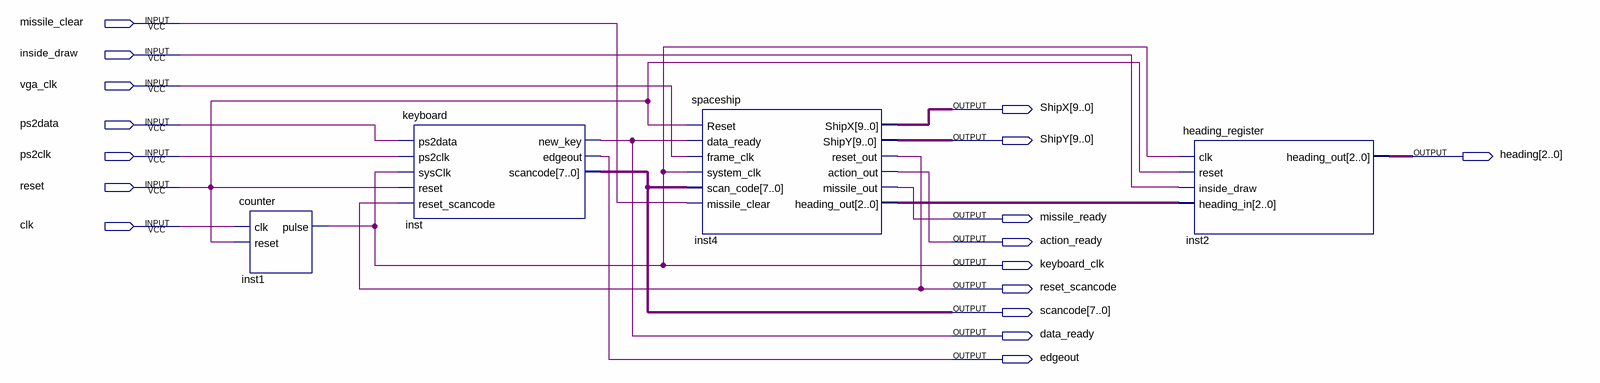
[diagram p0: schematic sheet]
// Quartus schematic ship_move.bdf as structural Verilog: 4 symbols, 17 pins
module ship_move (
  input  missile_clear,
  input  inside_draw,
  input  vga_clk,
  input  ps2data,
  input  ps2clk,
  input  reset,
  input  clk,
  output [9:0] ShipX,
  output [9:0] ShipY,
  output [2:0] heading,
  output missile_ready,
  output action_ready,
  output keyboard_clk,
  output reset_scancode,
  output [7:0] scancode,
  output data_ready,
  output edgeout
);

  wire [2:0] inst4_heading_out;

  counter inst1 (.clk(clk), .reset(reset), .pulse(keyboard_clk));
  keyboard inst (
    .ps2data(ps2data), .ps2clk(ps2clk), .sysClk(keyboard_clk), .reset(reset),
    .reset_scancode(reset_scancode), .new_key(data_ready), .edgeout(edgeout), .scancode(scancode));
  spaceship inst4 (
    .Reset(reset), .data_ready(data_ready), .frame_clk(vga_clk), .system_clk(keyboard_clk),
    .scan_code(scancode), .missile_clear(missile_clear), .ShipX(ShipX), .ShipY(ShipY),
    .reset_out(reset_scancode), .action_out(action_ready), .missile_out(missile_ready),
    .heading_out(inst4_heading_out));
  heading_register inst2 (
    .clk(keyboard_clk), .reset(reset), .inside_draw(inside_draw), .heading_in(inst4_heading_out),
    .heading_out(heading));
endmodule
